# EAGLE design touritu (EAGLE 7.2.0)
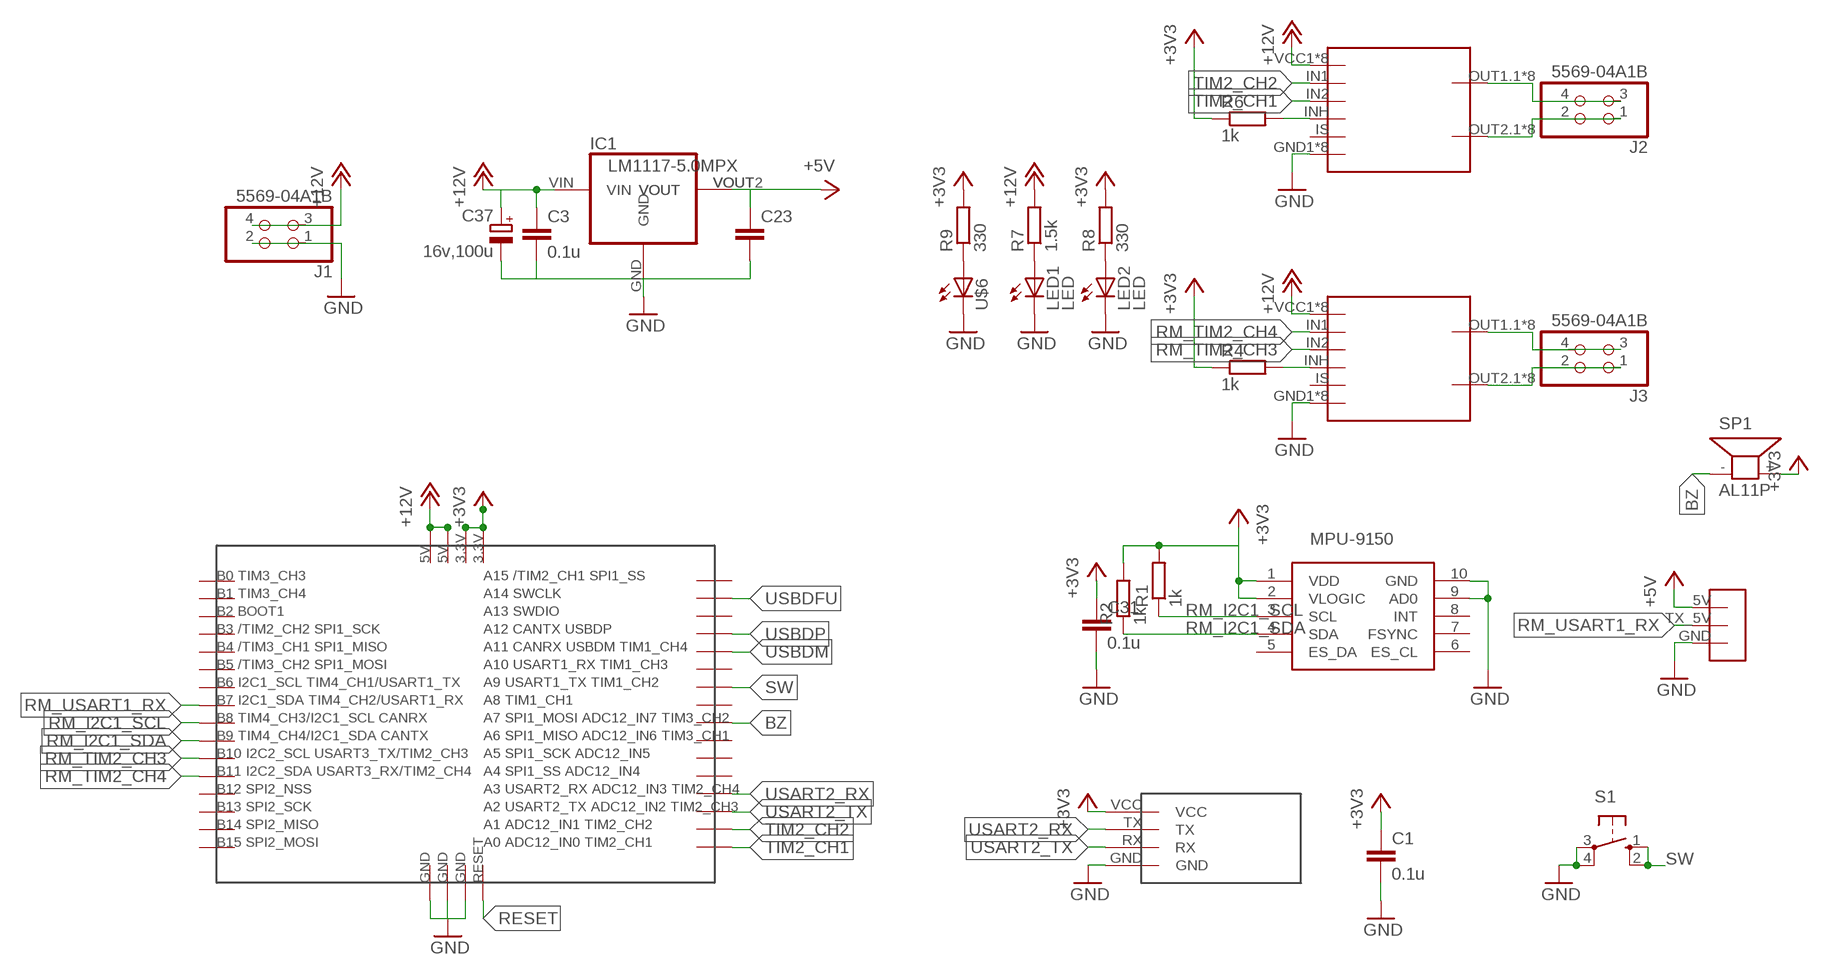
[diagram p0: schematic, sheet 1]

## Parts
C1  0.1u  C-EUC0603K  [C0603K]
C3  0.1u  C-EUC0603K  [C0603K]
C23  C-EUC0603K  [C0603K]
C31  0.1u  C-EUC0603K  [C0603K]
C37  16v,100u  CPOL-EU153CLV-0605  [153CLV-0605]
IC1  LM1117-5.0MPX  LM1117-5.0IMP  [SOT223]
J1  5569-04A1B  [5569-04A1_2]
J2  5569-04A1B  [5569-04A1_2]
J3  5569-04A1B  [5569-04A1_2]
LED1  LED  [T]
LED2  LED  [T]
MPU9150  MPU-9150  [MPU-9150]
R1  1k  R-EU_R0603  [R0603]
R2  1k  R-EU_R0603  [R0603]
R4  1k  R-EU_R0603  [R0603]
R6  1k  R-EU_R0603  [R0603]
R7  1.5k  R-EU_R0603  [R0603]
R8  330  R-EU_R0603  [R0603]
R9  330  R-EU_R0603  [R0603]
S1  10-XX  [B3F-10XX]
SP1  AL11P  [AL11P]
U$1  STBE_MINI  [STBEE_MINI]
U$2  XBEE_2.54  [XBEE_2.54]
U$4  BTM7752  [BTM7752]
U$6  0603  [0603]
U$7  SBDBT_5V  [SBDBT_5V]
U$9  BTM7752  [BTM7752]

## Nets
+3V3: C1.1 C31.1 MPU9150.1(VDD) MPU9150.2(VLOGIC) R1.2 R2.2 R4.1 R6.1 R8.2 R9.2 SP1.+ U$1.3.3V1 U$1.3.3V2 U$2.VCC
+5V [VCC]: C23.1 IC1.VOUT IC1.VOUT2(VOUT) U$7.5V
+12V: C3.1 C37.+ IC1.VIN J1.3 J1.4 R7.2 U$1.5V1 U$1.5V2 U$4.VCC1(VCC) U$4.VCC2(VCC) U$4.VCC3(VCC) U$4.VCC4(VCC) U$4.VCC5(VCC) U$4.VCC6(VCC) U$4.VCC7(VCC) U$4.VCC8(VCC) U$9.VCC1(VCC) U$9.VCC2(VCC) U$9.VCC3(VCC) U$9.VCC4(VCC) U$9.VCC5(VCC) U$9.VCC6(VCC) U$9.VCC7(VCC) U$9.VCC8(VCC)
BZ: SP1.- U$1.A7
GND [GND]: C1.2 C3.2 C23.2 C31.2 C37.- IC1.GND J1.1 J1.2 LED1.P$2(C) LED2.P$2(C) MPU9150.9(AD0) MPU9150.10(GND) S1.3(P) S1.4(P1) U$1.GND1 U$1.GND2 U$1.GND3 U$2.GND U$4.GND1(GND) U$4.GND2(GND) U$4.GND3(GND) U$4.GND4(GND) U$4.GND5(GND) U$4.GND6(GND) U$4.GND7(GND) U$4.GND8(GND) U$6.C U$7.GND U$9.GND1(GND) U$9.GND2(GND) U$9.GND3(GND) U$9.GND4(GND) U$9.GND5(GND) U$9.GND6(GND) U$9.GND7(GND) U$9.GND8(GND)
N$1: LED1.P$1(A) R7.1
N$3: R6.2 U$4.INH
N$4: J2.3 J2.4 U$4.OUT1.1(OUT1) U$4.OUT1.2(OUT1) U$4.OUT1.3(OUT1) U$4.OUT1.4(OUT1) U$4.OUT1.5(OUT1) U$4.OUT1.6(OUT1) U$4.OUT1.7(OUT1) U$4.OUT1.8(OUT1)
N$5: J2.1 J2.2 U$4.OUT2.1(OUT2) U$4.OUT2.2(OUT2) U$4.OUT2.3(OUT2) U$4.OUT2.4(OUT2) U$4.OUT2.5(OUT2) U$4.OUT2.6(OUT2) U$4.OUT2.7(OUT2) U$4.OUT2.8(OUT2)
N$8: LED2.P$1(A) R8.1
N$11: R4.2 U$9.INH
N$12: J3.3 J3.4 U$9.OUT1.1(OUT1) U$9.OUT1.2(OUT1) U$9.OUT1.3(OUT1) U$9.OUT1.4(OUT1) U$9.OUT1.5(OUT1) U$9.OUT1.6(OUT1) U$9.OUT1.7(OUT1) U$9.OUT1.8(OUT1)
N$13: J3.1 J3.2 U$9.OUT2.1(OUT2) U$9.OUT2.2(OUT2) U$9.OUT2.3(OUT2) U$9.OUT2.4(OUT2) U$9.OUT2.5(OUT2) U$9.OUT2.6(OUT2) U$9.OUT2.7(OUT2) U$9.OUT2.8(OUT2)
N$15: R9.1 U$6.A
RESET: U$1.RESET
RM_I2C1_SCL: MPU9150.3(SCL) R1.1 U$1.B8
RM_I2C1_SDA: MPU9150.4(SDA) R2.1 U$1.B9
RM_TIM2_CH3: U$1.B10 U$9.IN2
RM_TIM2_CH4: U$1.B11 U$9.IN1
RM_USART1_RX: U$1.B7 U$7.TX_5V
SW: S1.1(S) S1.2(S1) U$1.A9
TIM2_CH1: U$1.A0 U$4.IN2
TIM2_CH2: U$1.A1 U$4.IN1
USART2_RX: U$1.A3 U$2.TX
USART2_TX: U$1.A2 U$2.RX
USBDFU: U$1.A14
USBDM: U$1.A11
USBDP: U$1.A12
Unconnected: MPU9150.5(ES_DA) MPU9150.6(ES_CL) MPU9150.7(FSYNC) MPU9150.8(INT) U$1.A4 U$1.A5 U$1.A6 U$1.A8 U$1.A10 U$1.A13 U$1.A15 U$1.B0 U$1.B1 U$1.B2 U$1.B3 U$1.B4 U$1.B5 U$1.B6 U$1.B12 U$1.B13 U$1.B14 U$1.B15 U$4.IS U$9.IS

## Library data of the parts
C1 C3 C23 C31 = resistor:C-EU: CAPACITOR, European symbol
C37 = rcl:CPOL-EU: POLARIZED CAPACITOR, European symbol
IC1 = Regulator:LM1117: 800mA and 1A Low Dropout (LDO) Positive Regulator 1.8V, 2.5V, 2.85V, 3.3V, 5V, and Adj
J1-J3 = Molex:5569-04A1
LED1 LED2 = T_LED:LED: LED - LUMILED® LXK2-PW12-R00, LXK2-PW12-S00, LXK2-PW14-U00, LXK2-PW14-V00 LXK2-PM12-R00, LXK2-PM12-S00, LXK2-PM14-U00 LXK2-PE12-Q00, LXK2-PE12-R00, LXK2-PE12-S00, LXK2-PE14-T00, LXK2-PE14-U00 LXK2-PB12-K00, LXK2-PB12-L00, LXK2-PB12-M00, LXK2-PB14-N00, LXK2-PB14-P00, LXK2-PB14-Q00 LXK2-PR12-L00, LXK2-PR12-M00, LXK2-PR14-Q00, LXK2-PR14-R00 LXK2-PD12-Q00, LXK2-PD12-R00, LXK2-PD12-S00 LXK2-PH12-R00, LXK2-PH12-S00 LXK2-PL12-P00, LXK2-PL12-Q00, LXK2-PL12-R00 Source: www.luxeon.com
MPU9150 = MPU-9150:MPU-9150
R1 R2 R4 R6-R9 = rcl:R-EU_: RESISTOR, European symbol
S1 = switch-omron:10-XX: OMRON SWITCH; MPN: B3F-1000; OC_FARNELL: 176432; OC_NEWARK: 36M3542
SP1 = buzzer:AL11P: SPEAKER Source: Buerklin; OC_FARNELL: unknown; OC_NEWARK: unknown
U$1 = stbee_mini:STBE_MINI
U$2 = xbee_254:XBEE_2.54
U$4 U$9 = BTM7752:BTM7752
U$6 = led_0603:0603
U$7 = SBDBT_5V:SBDBT_5V

## Board
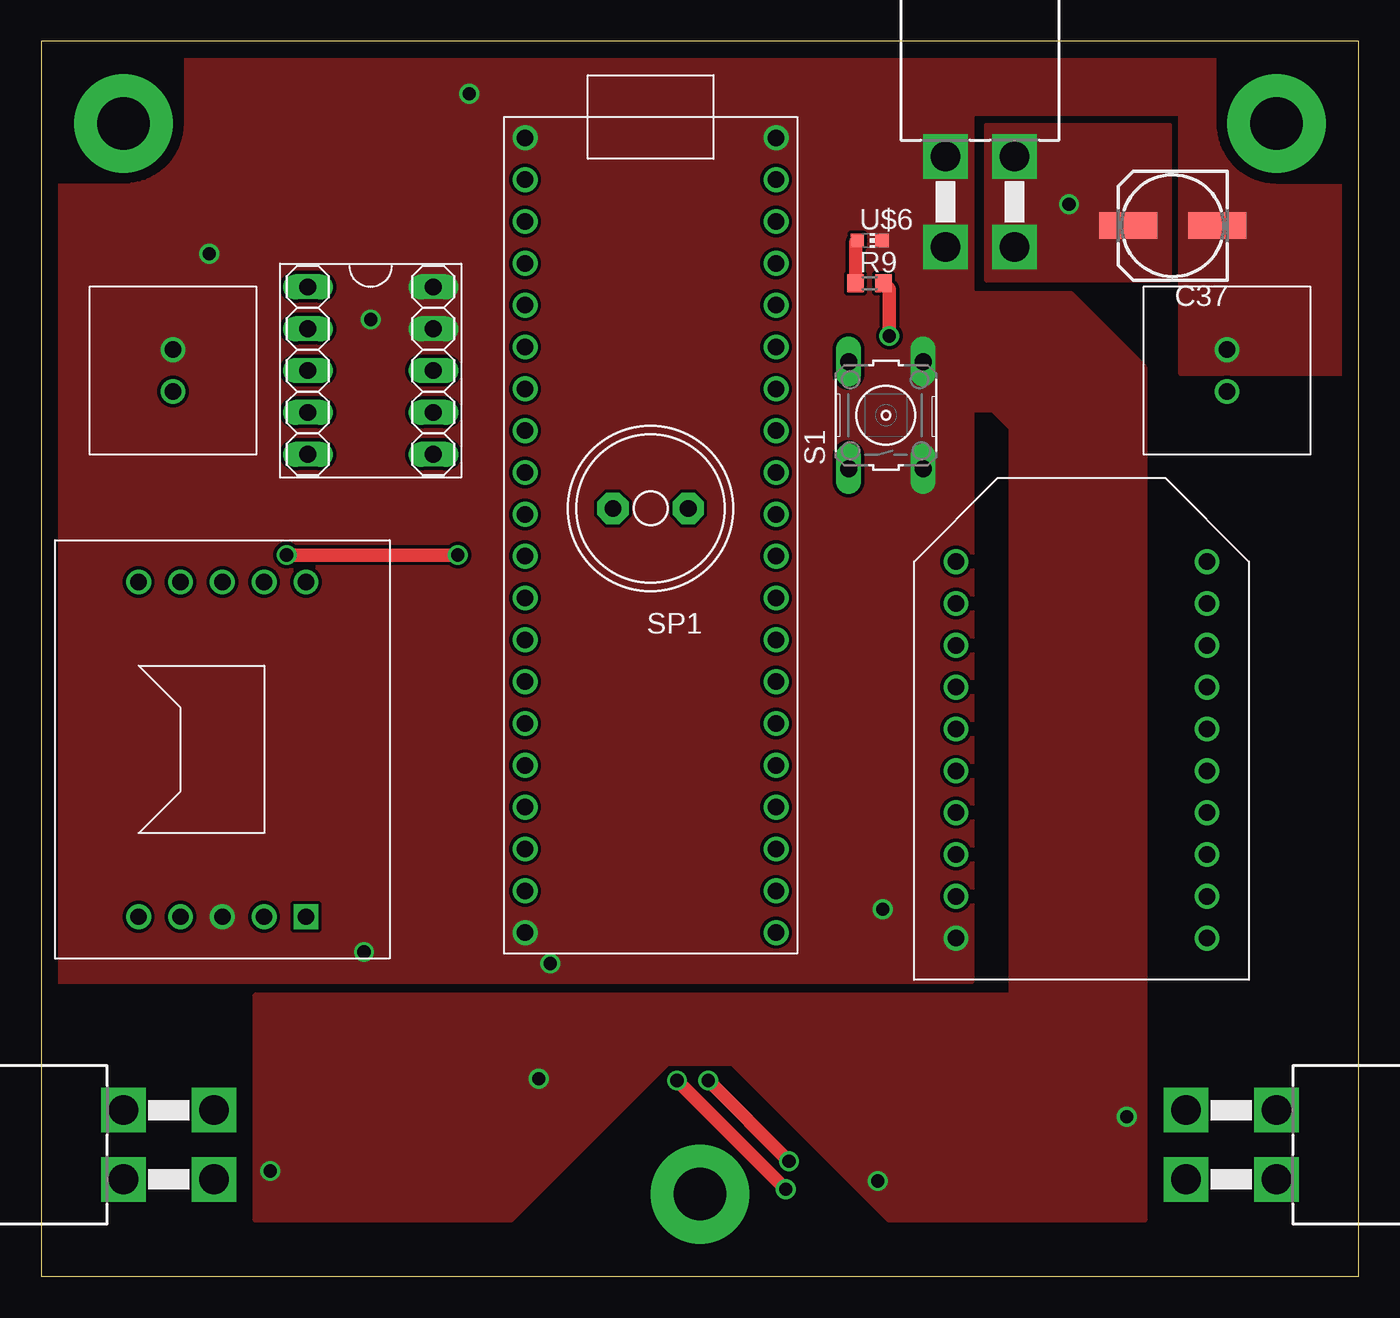
[diagram p1: board, top side]
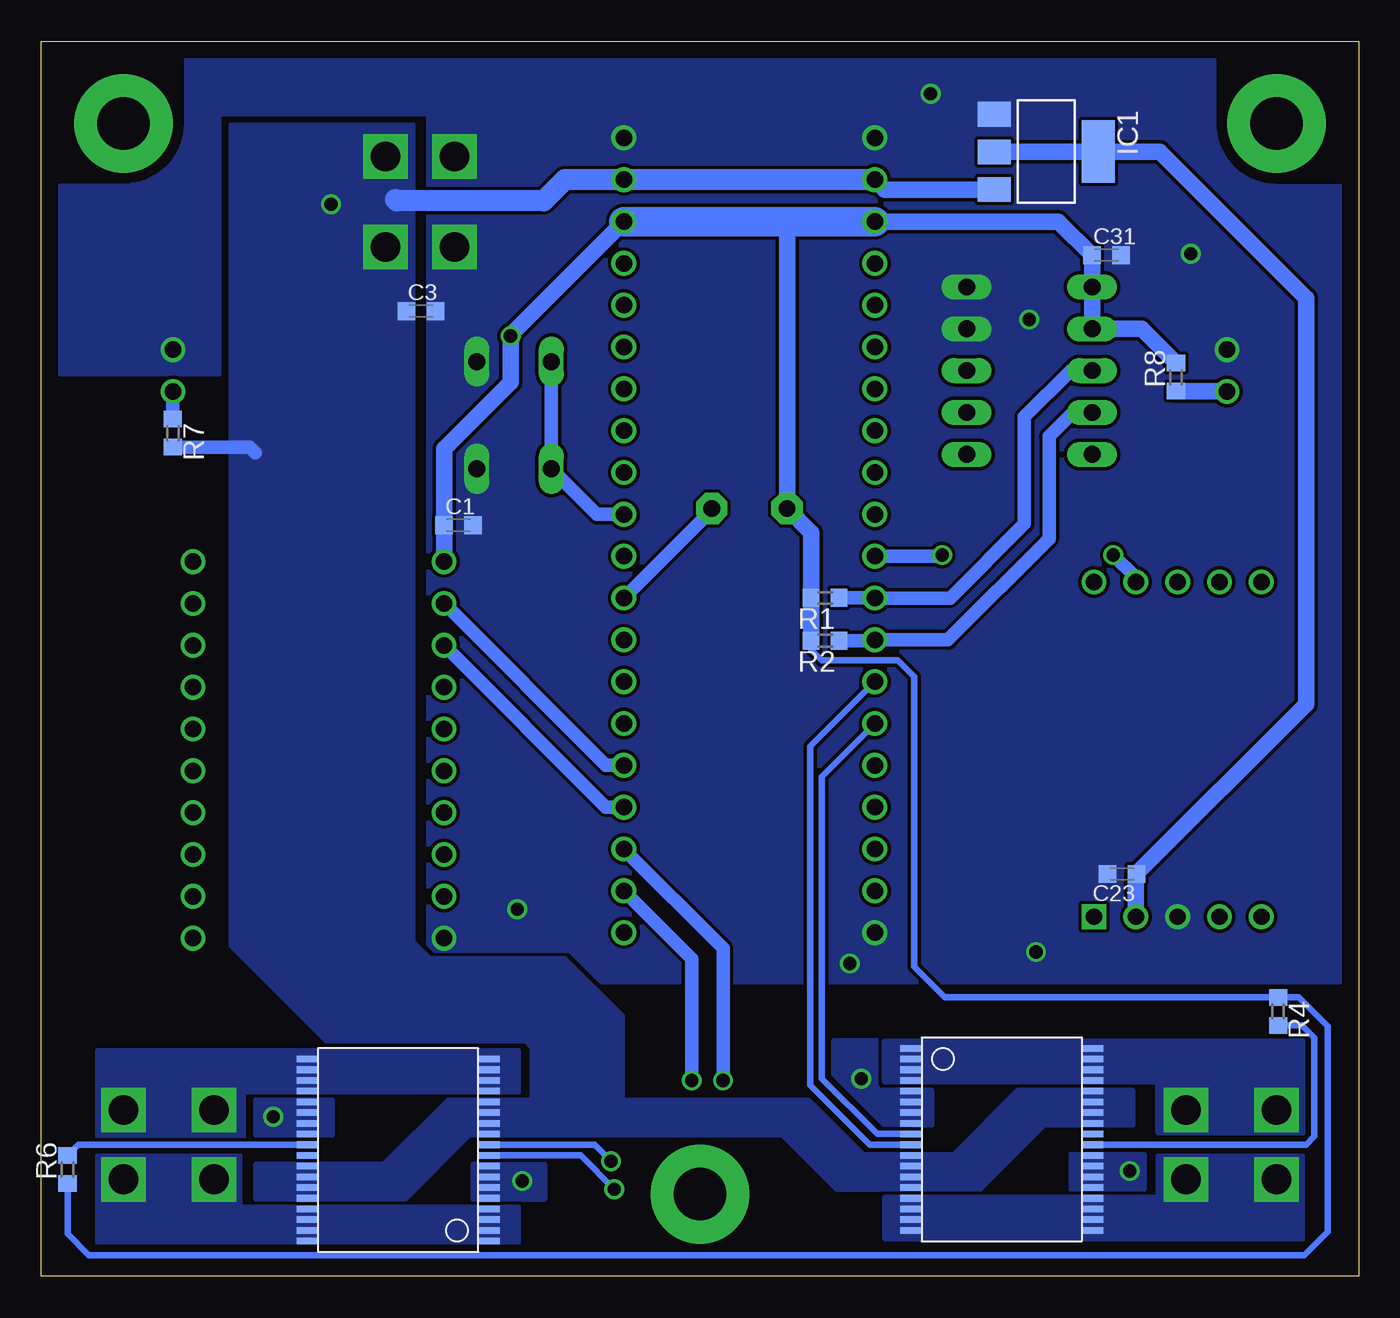
[diagram p2: board, bottom side, seen from below]

Size 80 x 75 mm. Coordinates in mm from the lower left corner, seen from the top.
Outline: 0,0 80,0 80,75 0,75 0,0
Copper layers (1*16): Top 0.035mm / dielectric 1.5mm / Bottom 0.035mm
Design rules "default": minimum track width 10mil, minimum drill 24mil, track to track 8mil, track to pad 8mil, pad to pad 8mil, via to via 8mil, smd to smd 8mil, copper to edge 40mil, drill to drill 8mil, minimum pad ring 10mil, minimum via ring 8mil, stop-mask expansion 4mil, vias tented up to drill 0mil, thermal gap 10mil
tRestrict: 6 lines
bRestrict: 6 lines

### Footprints (pad centres in the part's own frame; a part is rotated, then mirrored left to right if it is on the bottom)
C0603K = smd 1.05 x 1.08: 1 -0.875,0; 2 0.875,0
153CLV-0605 = smd 3.5 x 1.6: + 2.7,0; - -2.7,0
SOT223 = smd 1.499 x 2.007: GND -2.261,-3.15; VIN 2.311,-3.15; VOUT 0.025,-3.15 | smd 3.81 x 2.007: VOUT2 0,3.15
5569-04A1_2 = drill 1.8 square: 1 2.1,0; 2 2.1,5.5; 3 -2.1,0; 4 -2.1,5.5
T = drill 1: P$1 0,-1.27; P$2 0,1.27
MPU-9150 = drill 1.016 long: 1 -3.81,5.08; 2 -3.81,2.54; 3 -3.81,0; 4 -3.81,-2.54; 5 -3.81,-5.08; 6 3.81,-5.08; 7 3.81,-2.54; 8 3.81,0; 9 3.81,2.54; 10 3.81,5.08
R0603 = smd 1 x 1.1: 1 -0.85,0; 2 0.85,0
B3F-10XX = drill 1.016 long: 1 -3.251,2.261; 2 3.251,2.261; 3 -3.251,-2.261; 4 3.251,-2.261
AL11P = drill 1.016 pad 1.905 octagon: + 2.286,0; - -2.286,0
STBEE_MINI = drill 1: 3.3V1 -7.62,19.05; 3.3V2 7.62,19.05; 5V1 -7.62,21.59; 5V2 7.62,21.59; A0 7.62,-21.59; A1 7.62,-19.05; A2 7.62,-16.51; A3 7.62,-13.97; A4 7.62,-11.43; A5 7.62,-8.89; A6 7.62,-6.35; A7 7.62,-3.81; A8 7.62,-1.27; A9 7.62,1.27; A10 7.62,3.81; A11 7.62,6.35; A12 7.62,8.89; A13 7.62,11.43; A14 7.62,13.97; A15 7.62,16.51; B0 -7.62,16.51; B1 -7.62,13.97; B2 -7.62,11.43; B3 -7.62,8.89; B4 -7.62,6.35; B5 -7.62,3.81; B6 -7.62,1.27; B7 -7.62,-1.27; B8 -7.62,-3.81; B9 -7.62,-6.35; B10 -7.62,-8.89; B11 -7.62,-11.43; B12 -7.62,-13.97; B13 -7.62,-16.51; B14 -7.62,-19.05; B15 -7.62,-21.59; GND1 -7.62,24.13; GND2 -7.62,-24.13; GND3 7.62,24.13; RESET 7.62,-24.13
XBEE_2.54 = drill 1: GND 2.54,2.54; P$2 2.54,5.08; P$3 2.54,7.62; P$4 2.54,10.16; P$5 2.54,12.7; P$6 2.54,15.24; P$7 2.54,17.78; P$11 17.78,2.54; P$12 17.78,5.08; P$13 17.78,7.62; P$14 17.78,10.16; P$15 17.78,12.7; P$16 17.78,15.24; P$17 17.78,17.78; P$18 17.78,20.32; P$19 17.78,22.86; P$20 17.78,25.4; RX 2.54,20.32; TX 2.54,22.86; VCC 2.54,25.4
BTM7752 = smd 1.27 x 0.4: GND1 -5.2,3.25; GND2 -5.2,2.6; GND3 -5.2,1.95; GND4 -5.2,1.3; GND5 5.85,-0.65; GND6 5.85,-1.3; GND7 5.85,-1.95; GND8 5.85,-2.6; IN1 -5.2,0.65; IN2 -5.2,0; INH 5.85,0; IS 5.85,0.65; OUT1.1 -5.2,5.85; OUT1.2 -5.2,5.2; OUT1.3 -5.2,4.55; OUT1.4 -5.2,3.9; OUT1.5 5.85,5.85; OUT1.6 5.85,5.2; OUT1.7 5.85,4.55; OUT1.8 5.85,3.9; OUT2.1 -5.2,-3.25; OUT2.2 -5.2,-3.9; OUT2.3 -5.2,-4.55; OUT2.4 -5.2,-5.2; OUT2.5 5.85,-3.25; OUT2.6 5.85,-3.9; OUT2.7 5.85,-4.55; OUT2.8 5.85,-5.2; VCC1 -5.2,-0.65; VCC2 -5.2,-1.3; VCC3 -5.2,-1.95; VCC4 -5.2,-2.6; VCC5 5.85,3.25; VCC6 5.85,2.6; VCC7 5.85,1.95; VCC8 5.85,1.3
0603 = smd 0.8 x 0.8: A 0,-0.75; C 0,0.75
SBDBT_5V = drill 1 square: 1 10.16,5.08 | drill 1: 4 10.16,-2.54; 5 10.16,-5.08; 5V 10.16,2.54; 6 -10.16,5.08; 8 -10.16,0; 9 -10.16,-2.54; 10 -10.16,-5.08; GND 10.16,0; TX_5V -10.16,2.54

### Placement (x,y rotation side)
C1  54.66,45.61 0 bottom
C3  56.94,58.61 0 bottom
C23  14.38,24.44 180 bottom
C31  15.32,62.01 0 bottom
C37  68.7,63.8 180 top
IC1  18.98,68.3 270 bottom
J1  57,68 180 top
J2  75,8 90 top
J3  5,8 270 top
LED1  72,55 0 top
LED2  8,55 0 top
MPU9150  20,55 0 top
R1  32.4,41.2 180 bottom
R2  32.4,38.6 180 bottom
R4  4.9,16.1 270 bottom
R6  78.4,6.5 90 bottom
R7  72,51.2 270 bottom
R8  11.1,54.6 90 bottom
R9  50.3,60.3 0 top
S1  51.29,52.29 90 top
SP1  37,46.63 180 top
U$1  37,45 0 top
U$2  53,18 0 top
U$4  58,8 180 bottom
U$6  50.3,62.9 270 top
U$7  11,32 270 top
U$9  22,8 0 bottom

### Tracks (layer width: path | path; a pad name or v marks a point on that pad's centre or on a via)
+3V3  (via drill 0.8)
  Top 0.813: R9.2 51.5,59.95 v51.5,57.1
  Bottom 0.406: R2.2 33.25,38.05 32.6,37.4 28,37.4 27,36.4 27,18.8 25.15,16.95 R4.1 3.65,16.95 1.9,15.2 1.9,2.7 3.3,1.3 77.1,1.3 78.4,2.6 R6.1
  Bottom 1.016: U$1.3.3V1 18.23,64.05 C31.1 MPU9150.1 MPU9150.2 13.19,57.54 R8.2 | 34.9,64.05 34.71,63.86 SP1.+ 33.25,45.17 R1.2 R2.2 | U$2.VCC C1.1 55.53,50.27 51.5,54.3 v51.5,57.1 51.5,57.17 U$1.3.3V2
  Bottom 1.778: U$1.3.3V1 34.9,64.05 U$1.3.3V2
+5V
  Bottom 1.016: IC1.VOUT 15.86,68.28 IC1.VOUT2 12.1,68.3 3.2,59.4 3.2,34.74 C23.1 13.54,24.41 U$7.5V
+12V  (via drill 0.8)
  Bottom 0.813: R7.2 67.35,50.35 67,50
  Bottom 1.016: IC1.VIN 28.78,65.99 U$1.5V1
  Bottom 1.27: U$1.5V1 U$1.5V2 48.21,66.59 49.5,65.3 58.4,65.3 58.5,65.4
  other vias: 62.4,65.1
  pour Bottom (rank 2, no thermals): 13.7,11.3 20.7,11.3 24.6,7.4 30.1,7.4 33.4,10.7 55.3,10.7 59.2,6.8 67,6.8 67,4.7 57.9,4.7 54,8.6 35,8.6 31.7,5.3 23,5.3 19.1,9.2 13.7,9.2
  pour Bottom (no thermals): 57.4,69.9 68.5,69.9 68.5,20.1 62.7,14.3 50.6,14.3 50.2,13.9 50.2,10 44.7,10 44.7,15.8 48.2,19.3 56.4,19.3 57.4,20.3
  pour Top (no thermals): 57.4,69.9 68.5,69.9 68.5,60.5 57.4,60.5
BZ
  Bottom 0.813: U$1.A7 39.29,46.52 SP1.-
GND  (via drill 0.8)
  other vias: 50.8,5.8 13.9,6.4 30.2,12 65.9,9.7 51.1,22.3 30.9,19 19.6,19.7 10.2,62.1 20,58.1 26,71.8
  pour Bottom (rank 6, no thermals): -4.1,78.7 56.5,78.7 56.5,17.9 -4.1,17.9
  pour Top (rank 6, no thermals): -7.1,78.7 56.5,78.7 56.5,17.9 -7.1,17.9
  pour Top (rank 6, no thermals): 13,17.1 67,17.1 67,3.4 51.5,3.4 42,12.9 38,12.9 28.5,3.4 13,3.4
  pour Bottom (rank 6, no thermals): 49.4,6.8 53.8,6.8 53.8,4.7 49.4,4.7
  pour Bottom (rank 6, no thermals): 13,7.4 17.5,7.4 17.5,5.3 13,5.3
  pour Bottom (rank 6, no thermals): 25.9,11.3 29.2,11.3 29.2,14.3 31.9,14.3 31.9,12.3 28.8,9.2 25.9,9.2
  pour Top (rank 6, no thermals): 52.5,59.7 62.5,59.7 67,55.2 67,8.6 58.9,8.6 58.9,51.5 57.8,52.6 52.5,52.6
  pour Bottom (rank 6, no thermals): 62.3,10.7 67,10.7 67,8.6 62.3,8.6
  pour Bottom (rank 6, no thermals): 54.4,77.3 84.5,77.3 84.5,54.8 69.2,54.8 69.2,70.6 54.4,70.6
  pour Top (rank 6, no thermals): 54.8,77.3 83.7,77.3 83.7,54.8 69.2,54.8 69.2,70.6 54.8,70.6
N$1
  Bottom 0.813: R7.1 LED1.P$1
N$3
  Bottom 0.406: U$4.INH 77.75,8 R6.2
N$4
  pour Bottom (no thermals): 51,4.2 67.9,4.2 67.9,7.3 76.6,7.3 76.6,2.5 76.6,2.1 62.2,2.1 51,2.1
N$5
  pour Bottom (no thermals): 51,13.7 76.6,13.7 76.6,8.5 67.7,8.5 67.7,11.2 51,11.2
N$8
  Bottom 1.016: R8.1 8.02,53.75 LED2.P$1
N$9  (via drill 3.2 pad 6)
  other vias: 40,5
N$10  (via drill 3.2 pad 6)
  other vias: 75,70
N$11
  Bottom 0.406: U$9.INH 3.2,8 2.7,8.5 2.7,14.5 3.45,15.25 R4.2
N$12
  pour Bottom (no thermals): 28.8,14.3 3.4,14.3 3.4,8.7 12.2,8.7 12.2,11.8 28.8,11.8
N$13
  pour Bottom (no thermals): 3.4,7.3 12.2,7.3 12.2,4.8 28.8,4.8 28.8,2.3 3.4,2.3
N$14  (via drill 3.2 pad 6)
  other vias: 5,70
N$15
  Top 0.813: R9.1 49.45,62.8 U$6.A
RM_I2C1_SCL
  Bottom 0.813: R1.1 U$1.B8 24.81,41.19 20.3,45.7 20.3,52.2 17.5,55 MPU9150.3
RM_I2C1_SDA
  Bottom 0.813: R2.1 29.43,38.6 U$1.B9 24.95,38.65 18.8,44.8 18.8,51 17.34,52.46 MPU9150.4
RM_TIM2_CH3
  Bottom 0.406: U$9.IN2 29.7,8 33.3,11.6 33.3,32.19 U$1.B10
RM_TIM2_CH4
  Bottom 0.406: U$9.IN1 29.25,8.65 32.6,12 32.6,30.35 U$1.B11
RM_USART1_RX  (via drill 0.8)
  Top 0.813: v25.3,43.8 v14.9,43.8
  Bottom 0.813: U$1.B7 25.37,43.73 v25.3,43.8 | v14.9,43.8 13.54,42.44 U$7.TX_5V
SW
  Bottom 0.813: S1.2 S1.1 46.26,46.27 U$1.A9
TIM2_CH1  (via drill 0.8)
  Top 0.813: v40.5,11.9 v45.4,7
  Bottom 0.406: v45.4,7 46.4,8 U$4.IN2
  Bottom 0.813: v40.5,11.9 40.5,19.29 U$1.A0
TIM2_CH2  (via drill 0.8)
  Top 0.813: v38.6,11.9 v45.2,5.3
  Bottom 0.406: v45.2,5.3 47.25,7.35 U$4.IN1
  Bottom 0.813: U$1.A1 38.6,19.93 v38.6,11.9
USART2_RX
  Bottom 0.813: U$1.A3 45.71,31.03 U$2.TX
USART2_TX
  Bottom 0.813: U$1.A2 45.71,28.49 U$2.RX